# Altium project APSS_SSTTraining_TeamRocket.PrjPcb
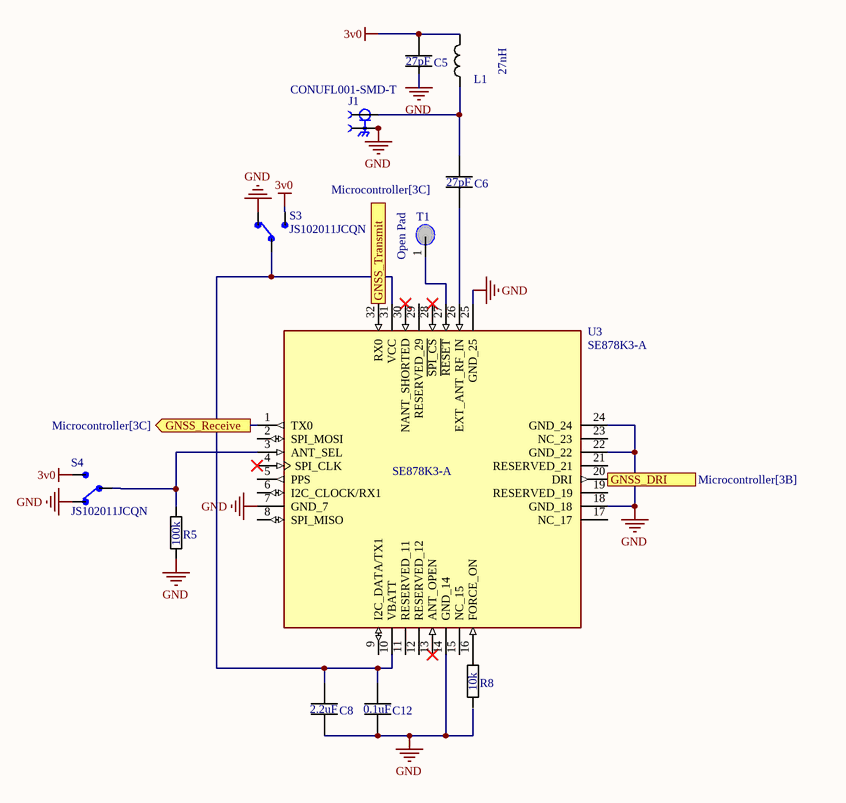
[diagram p0: GNNS_Module.SchDoc]
1 sheet, 12 parts. Net scope: flat (ports and power ports of the same name join across sheets).
Board file: Main_PCB.PcbDoc

## Sheet GNNS_Module.SchDoc
size A4; SheetNumber: 2; SheetTotal: 2

### Parts
C5  value 27pF  [0603 (Capacitor)]  (hidden comment: C-p-012.000-2-0603)
C6  value 27pF  [0603 (Capacitor)]  (hidden comment: C-p-012.000-2-0603)
C8  value 2.2uF  [0603 (Capacitor)]  (hidden comment: C-n-010.000-5-0603)
C12  value 0.1uF  [0603 (Capacitor)]  (hidden comment: C-n-001.000-5-0603)
J1  CONUFL001-SMD-T  [Antenna- CONUFL001-SMD-T]
L1  value 27nH  [4426R-9]  (hidden comment: L-n-027.000-5-0402)
R5  value 100k  [0603 (Resistor)]  (hidden comment: R-k-100.000-1-0603)
R8  value 10k  [0603 (Resistor)]  (hidden comment: R-k-010.000-1-0603)
S3  JS102011JCQN  [SW_JS102011JCQN]
S4  JS102011JCQN  [SW_JS102011JCQN]
T1  Open Pad  [Open Pad]
U3  SE878K3-A  [GNSS Module]

### Ports
GNSS_DRI (out, see Microcontroller[3B]), GNSS_Receive (out, see Microcontroller[3C]), GNSS_Transmit (in, see Microcontroller[3C])

### Nets
3v0: C5.1 L1.1 S3.3 S4.3
GND: C5.2 C8.2 C12.2 J1.2 J1.3 R5.2 S3.1 S4.1 U3.7(GND_7) U3.14(GND_14) U3.18(GND_18) U3.22(GND_22) U3.24(GND_24) U3.25(GND_25)
NetC6_1: C6.1 J1.1 L1.2
NetC6_2: C6.2 U3.26(EXT_ANT_RF_IN)
NetC8_1: C8.1 C12.1 S3.2 U3.10(VBATT) U3.31(VCC)
NetR5_1: R5.1 S4.2 U3.3(ANT_SEL)
NetR8_1: R8.1 U3.16(FORCE_ON)
NetT1_1: T1.1 U3.27(~{RESET})
NetU3_1: U3.1(TX0) ; port GNSS_Receive
NetU3_20: U3.20(DRI) ; port GNSS_DRI
NetU3_32: U3.32(RX0) ; port GNSS_Transmit

Not connected (* = marked no-connect by the designer): R8 2; U3 2(SPI_MOSI) 4(SPI_CLK)* 5(PPS) 6(I2C_CLOCK/RX1) 8(SPI_MISO) 9(I2C_DATA/TX1) 11(RESERVED_11) 12(RESERVED_12) 13(ANT_OPEN)* 15(NC_15) 17(NC_17) 19(RESERVED_19) 21(RESERVED_21) 23(NC_23) 28(~{SPI_CS})* 29(RESERVED_29) 30(NANT_SHORTED)*

### Library data of the parts
C5 C6 = C-p-012.000-2-0603: Capacitor 12pF 0603 +/-2%; Manufacturer: Murata; Manufacturer PartNo: GQM1875C2E120GB12D; Case/Package: 0603; Tolerance: +/-2%
C8 = C-n-010.000-5-0603: Capacitor 2.2uF 0603 +/-5%; Manufacturer: Murata; Manufacturer PartNo: GRM1885C1H103JA01D; Case/Package: 0603; Tolerance: +/-5%
C12 = C-n-001.000-5-0603: Capacitor 0.1uF 0603 +/-5%; Manufacturer: Murata; Manufacturer PartNo: GCM1885C2A102JA16D; Case/Package: 0603; Tolerance: +/-5%
L1 = L-n-027.000-5-0402: Inductor 27nH 0402 +/-5%; Manufacturer: Murata; Manufacturer PartNo: LQG15HS27NJ02D; Tolerance: +/-5%; Case/Package: 0402
R5 = R-k-100.000-1-0603: Resistor 100k 0603 +/-1%; Manufacturer: Vishay Dale; Manufacturer PartNo: CRCW0603100KFKEAHP; Tolerance: +/-1%; Case/Package: 0603
R8 = R-k-010.000-1-0603: Resistor 10k 0603 +/-1%; Manufacturer: Vishay Dale; Manufacturer PartNo: CRCW060310K0FKEAHP; Tolerance: +/-1%; Case/Package: 0603
S3 S4 = JS102011JCQN: Switch Slide Spdt 300ma 6v; Price: None; Value: *; Package: None; Availability: Unavailable; MP: JS102011JCQN
U3 = SE878K3-A: GNSS L1 Antenna module (GPS, Galileo, Glonass, BeiDou); MF: Telit; SnapEDA_Link: https://www.snapeda.com/parts/SE878K3-A/Telit/view-part/?ref=snap; Value: *; Check_prices: https://www.snapeda.com/parts/SE878K3-A/Telit/view-part/?ref=eda; Availability: Not in stock; Price: None; MP: SE878K3-A; Package: NON-STANDARD-32 Telit
J1 = CONUFL001-SMD-T: Availability: Unavailable; Package: None; MP: CONUFL001-SMD-T; Value: *; Price: None